# Altium schematic sheet CAN_PHY.SchDoc
size 420 x 297 mm; SheetNumber: 19; SheetTotal: 23
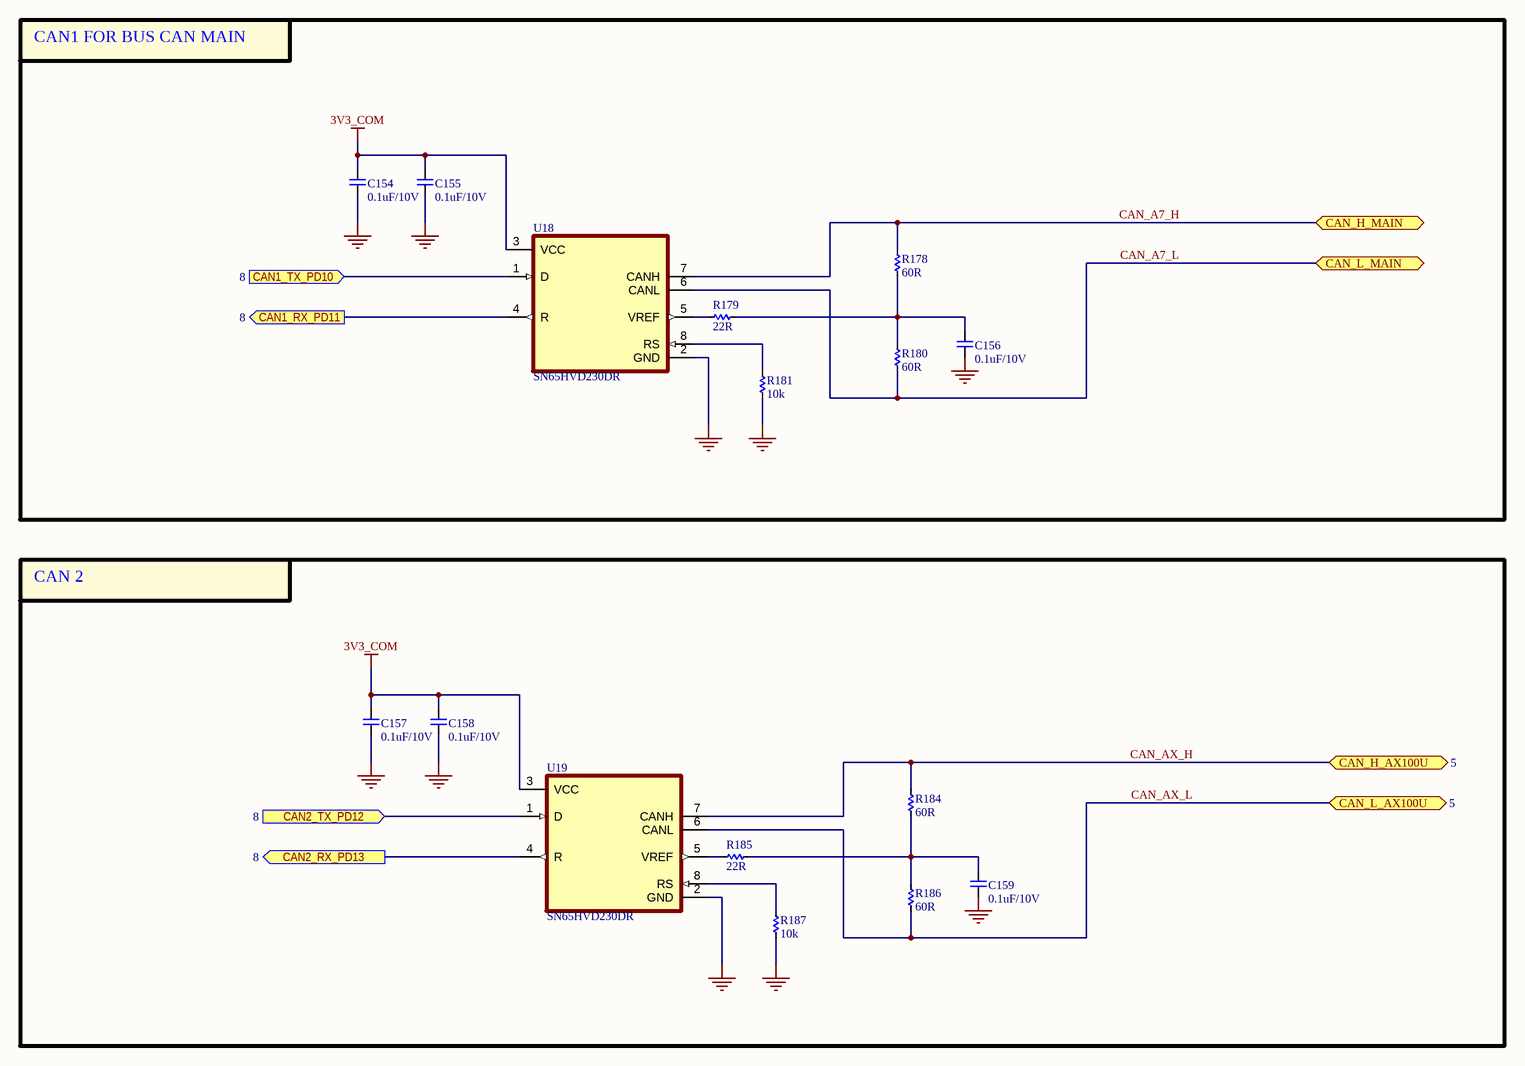
[diagram p0: CAN_PHY.SchDoc]

## Parts
C154  0.1uF/10V  [CAP_C_1005X50_L]
C155  0.1uF/10V  [CAP_C_1005X50_L]
C156  0.1uF/10V  [CAP_C_1005X50_L]
C157  0.1uF/10V  [CAP_C_1005X50_L]
C158  0.1uF/10V  [CAP_C_1005X50_L]
C159  0.1uF/10V  [CAP_C_1005X50_L]
R178  60R  [RES_C_1005x30_L]
R179  22R  [RES_C_1005x30_L]
R180  60R  [RES_C_1005x30_L]
R181  10k  [RES_C_1005x30_L]
R184  60R  [RES_C_1005x30_L]
R185  22R  [RES_C_1005x30_L]
R186  60R  [RES_C_1005x30_L]
R187  10k  [RES_C_1005x30_L]
U18  SN65HVD230DR  [SOIC127P599X175-8N]
U19  SN65HVD230DR  [SOIC127P599X175-8N]

## Blocks framed on the sheet
CAN1 FOR BUS CAN MAIN: C154-C156 R178-R181 U18
CAN 2: C157-C159 R184-R187 U19

## Ports
CAN1_RX_PD11 (out, see 8), CAN1_TX_PD10 (in, see 8), CAN2_RX_PD13 (out, see 8), CAN2_TX_PD12 (in, see 8), CAN_H_AX100U (bidir, see 5), CAN_H_MAIN (bidir, see 4, 5), CAN_L_AX100U (bidir, see 5), CAN_L_MAIN (bidir, see 4, 5)

## Nets
3V3_COM: C154.2 C155.2 C157.2 C158.2 U18.3(VCC) U19.3(VCC)
GND: C154.1 C155.1 C156.1 C157.1 C158.1 C159.1 R181.2 R187.2 U18.2(GND) U19.2(GND)
CAN1_RX_PD11: U18.4(R) ; port CAN1_RX_PD11
CAN1_TX_PD10: U18.1(D) ; port CAN1_TX_PD10
CAN2_RX_PD13: U19.4(R) ; port CAN2_RX_PD13
CAN2_TX_PD12: U19.1(D) ; port CAN2_TX_PD12
CAN_A7_H: R178.1 U18.7(CANH) ; port CAN_H_MAIN
CAN_A7_L: R180.2 U18.6(CANL) ; port CAN_L_MAIN
CAN_AX_H: R184.1 U19.7(CANH) ; port CAN_H_AX100U
CAN_AX_L: R186.2 U19.6(CANL) ; port CAN_L_AX100U
NetC156_2: C156.2 R178.2 R179.1 R180.1
NetC159_2: C159.2 R184.2 R185.1 R186.1
NetR179_2: R179.2 U18.5(VREF)
NetR181_1: R181.1 U18.8(RS)
NetR185_2: R185.2 U19.5(VREF)
NetR187_1: R187.1 U19.8(RS)

## Notes on the sheet
- Project:
- BEE-1012
- Sub-system:
- SATELLITE_EXP_CONTROLLER
- Design by:
- SANG HUYNH
- BAO BUI
- Sheet title:
- Sheet
- A3
- of
- Checked by:
- Approved by:
- VU PHAM
- Revision:
- Document No:
- Size:
- Date:

## Library data of the parts
C154-C159 = _CAP_C_2: CAP CHIP
R178-R181 R184-R187 = _RES_B_2: RES
U18 U19 = SN65HVD230DR: 3.3 V CAN Transceiver with Standby Mode; MF: Texas Instruments; SnapEDA_Link: https://www.snapeda.com/parts/SN65HVD230DR/Texas+Instruments/view-part/?ref=snap; Package: SOIC-8 Texas Instruments; Value: *; MP: SN65HVD230DR; Check_prices: https://www.snapeda.com/parts/SN65HVD230DR/Texas+Instruments/view-part/?ref=eda